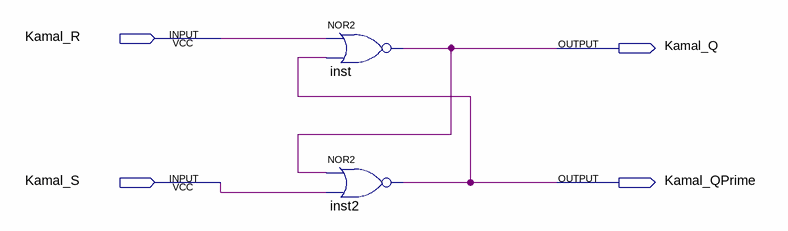
[diagram p0: schematic sheet]
// Quartus schematic Kamal_Faheem_SRLatch.bdf as structural Verilog: 2 symbols, 4 pins
module Kamal_Faheem_SRLatch (
  input  Kamal_R,
  input  Kamal_S,
  output Kamal_Q,
  output Kamal_QPrime
);

  nor inst (Kamal_Q, Kamal_R, Kamal_QPrime);
  nor inst2 (Kamal_QPrime, Kamal_Q, Kamal_S);
endmodule
